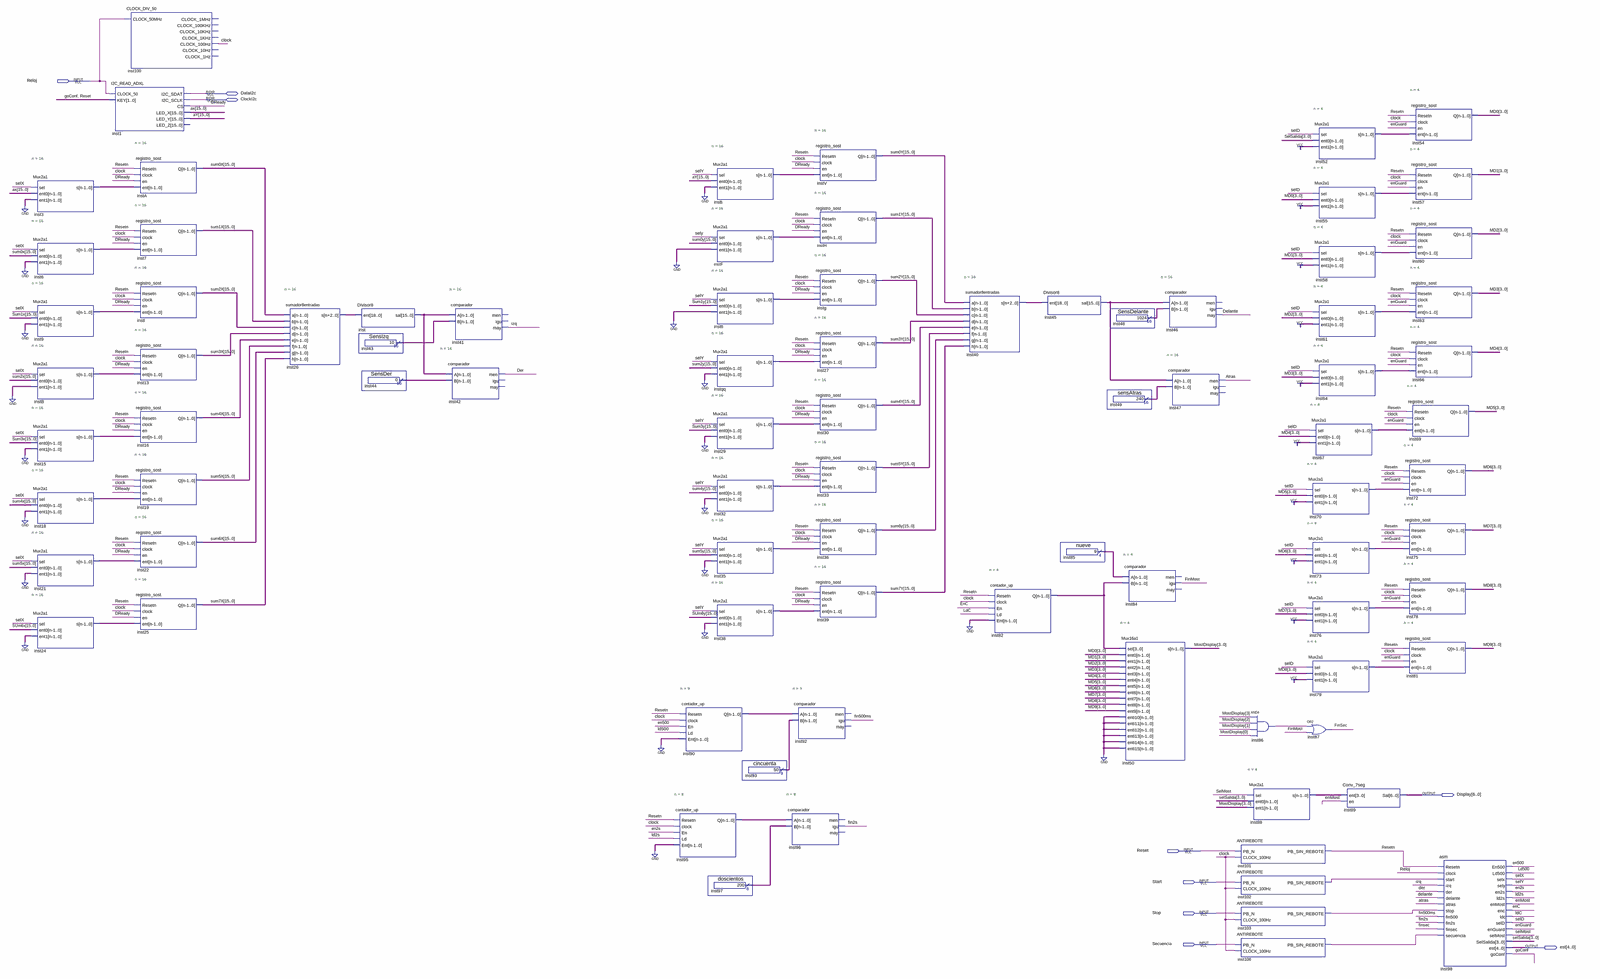
[diagram p0: schematic sheet, whole]
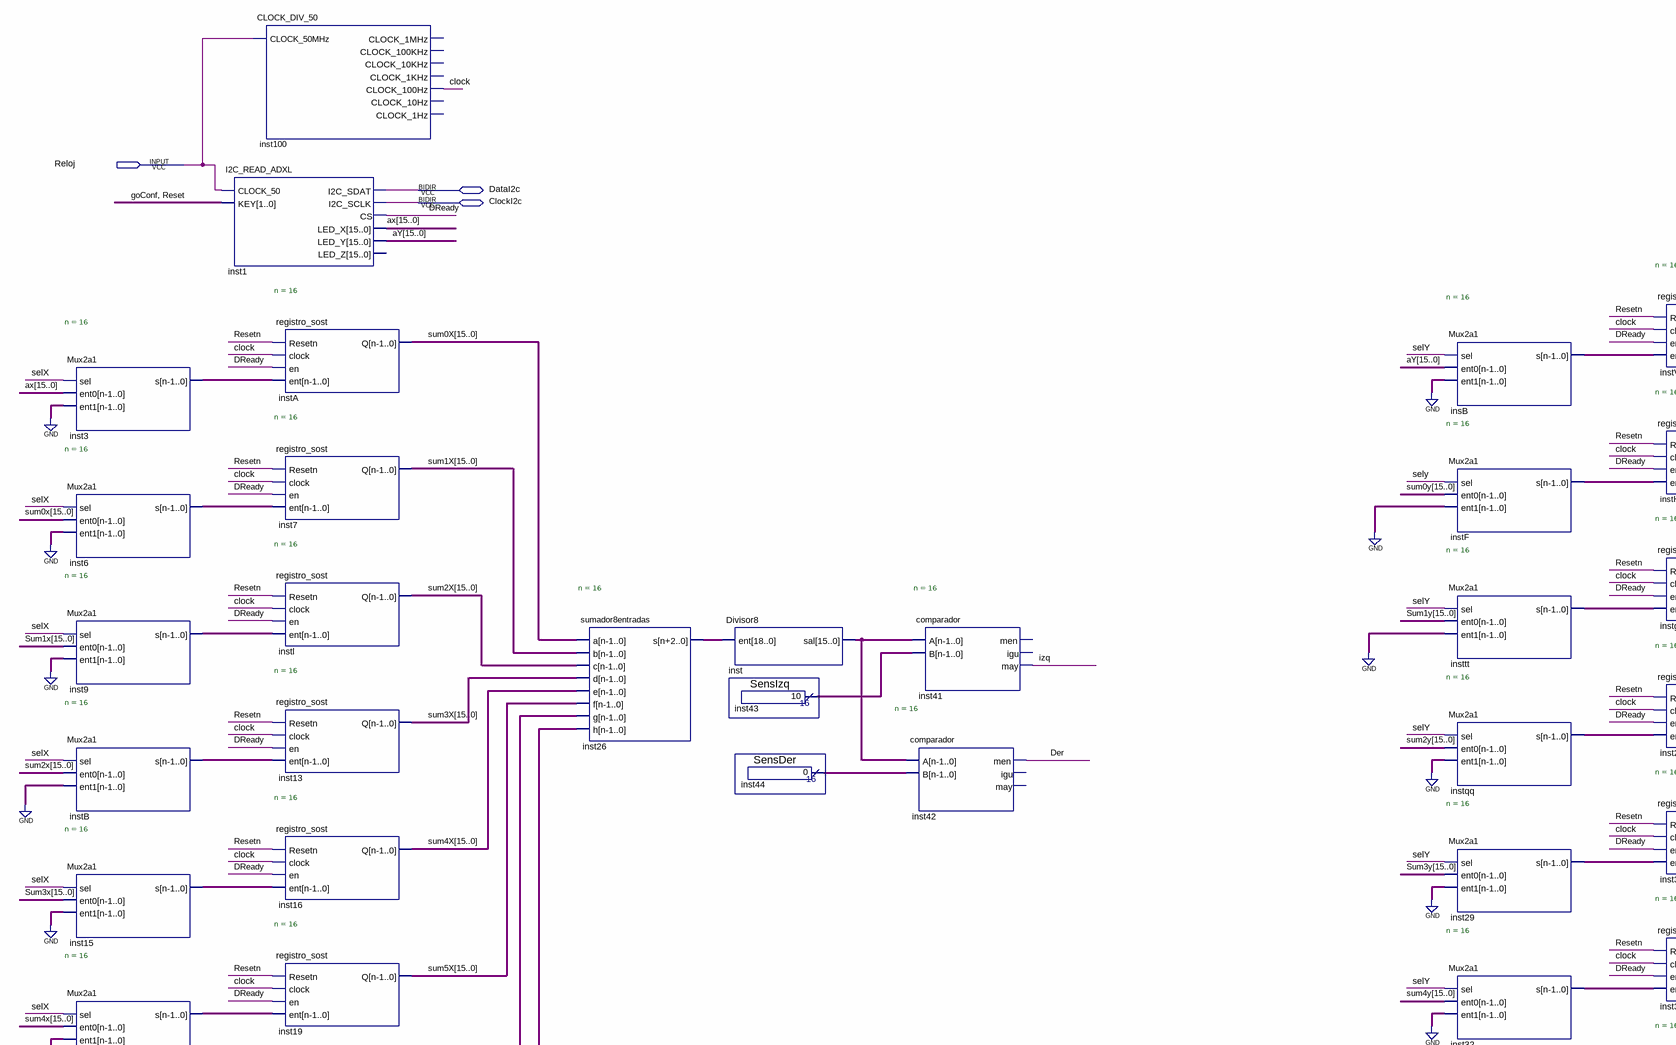
[diagram p1: schematic sheet, upper left part]
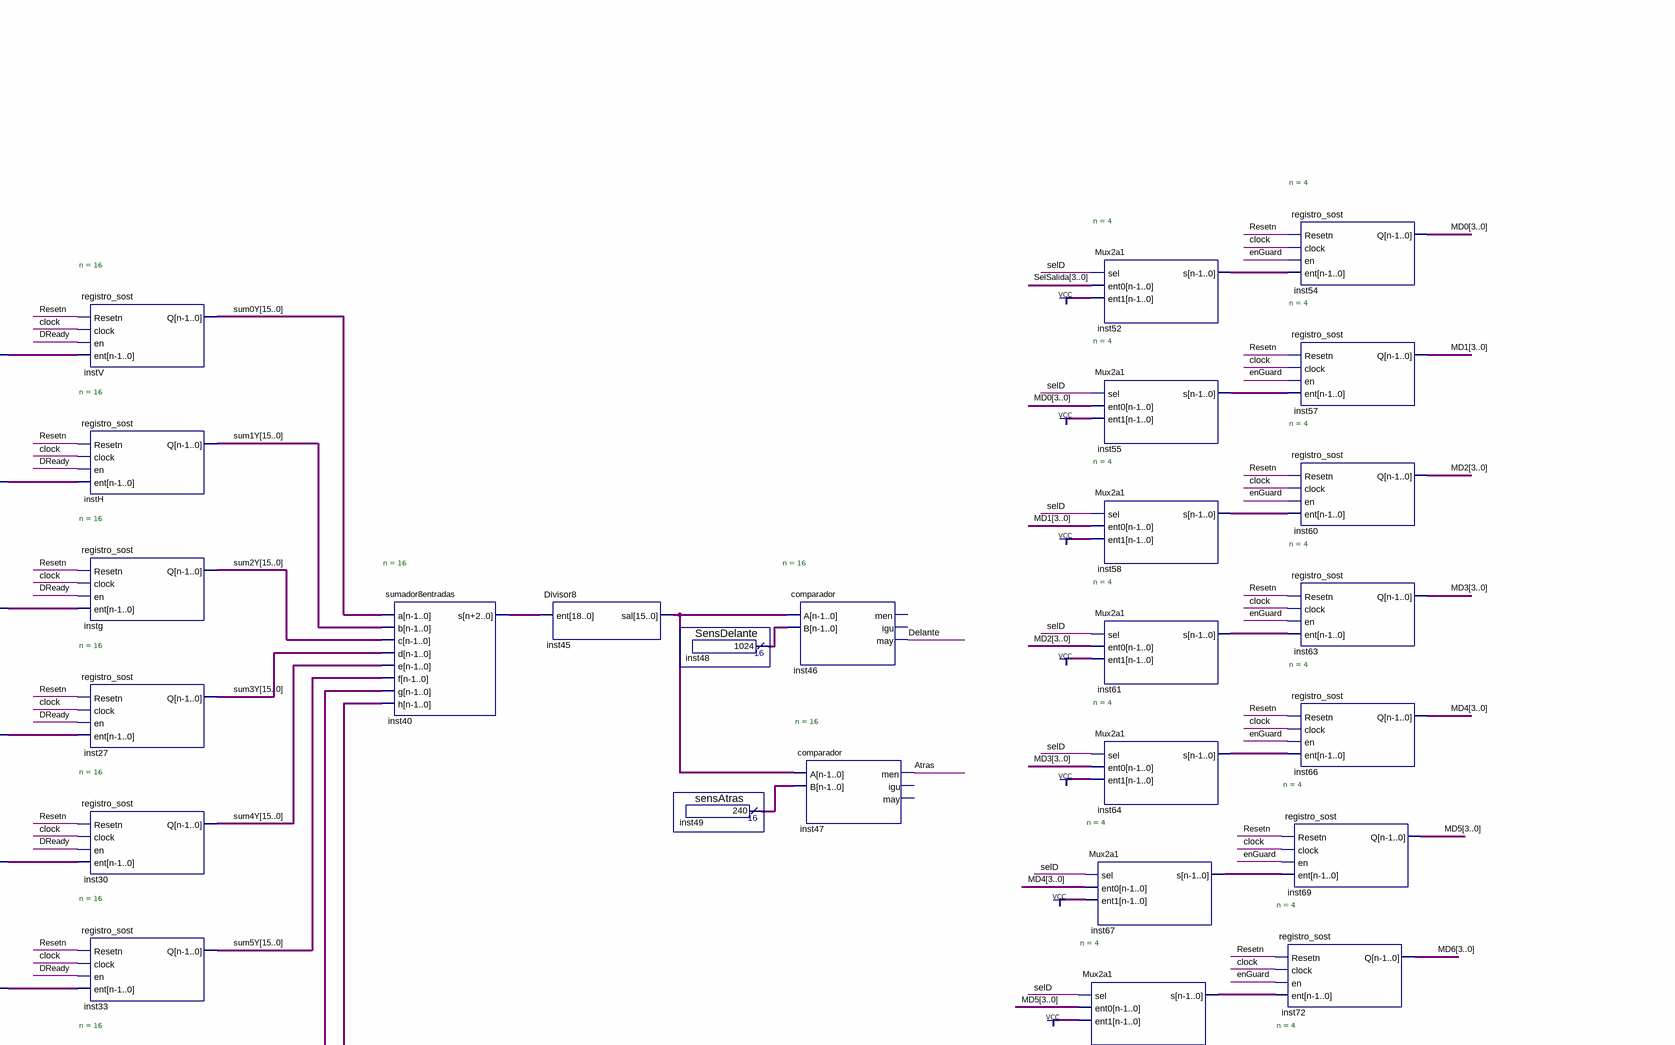
[diagram p2: schematic sheet, upper right part]
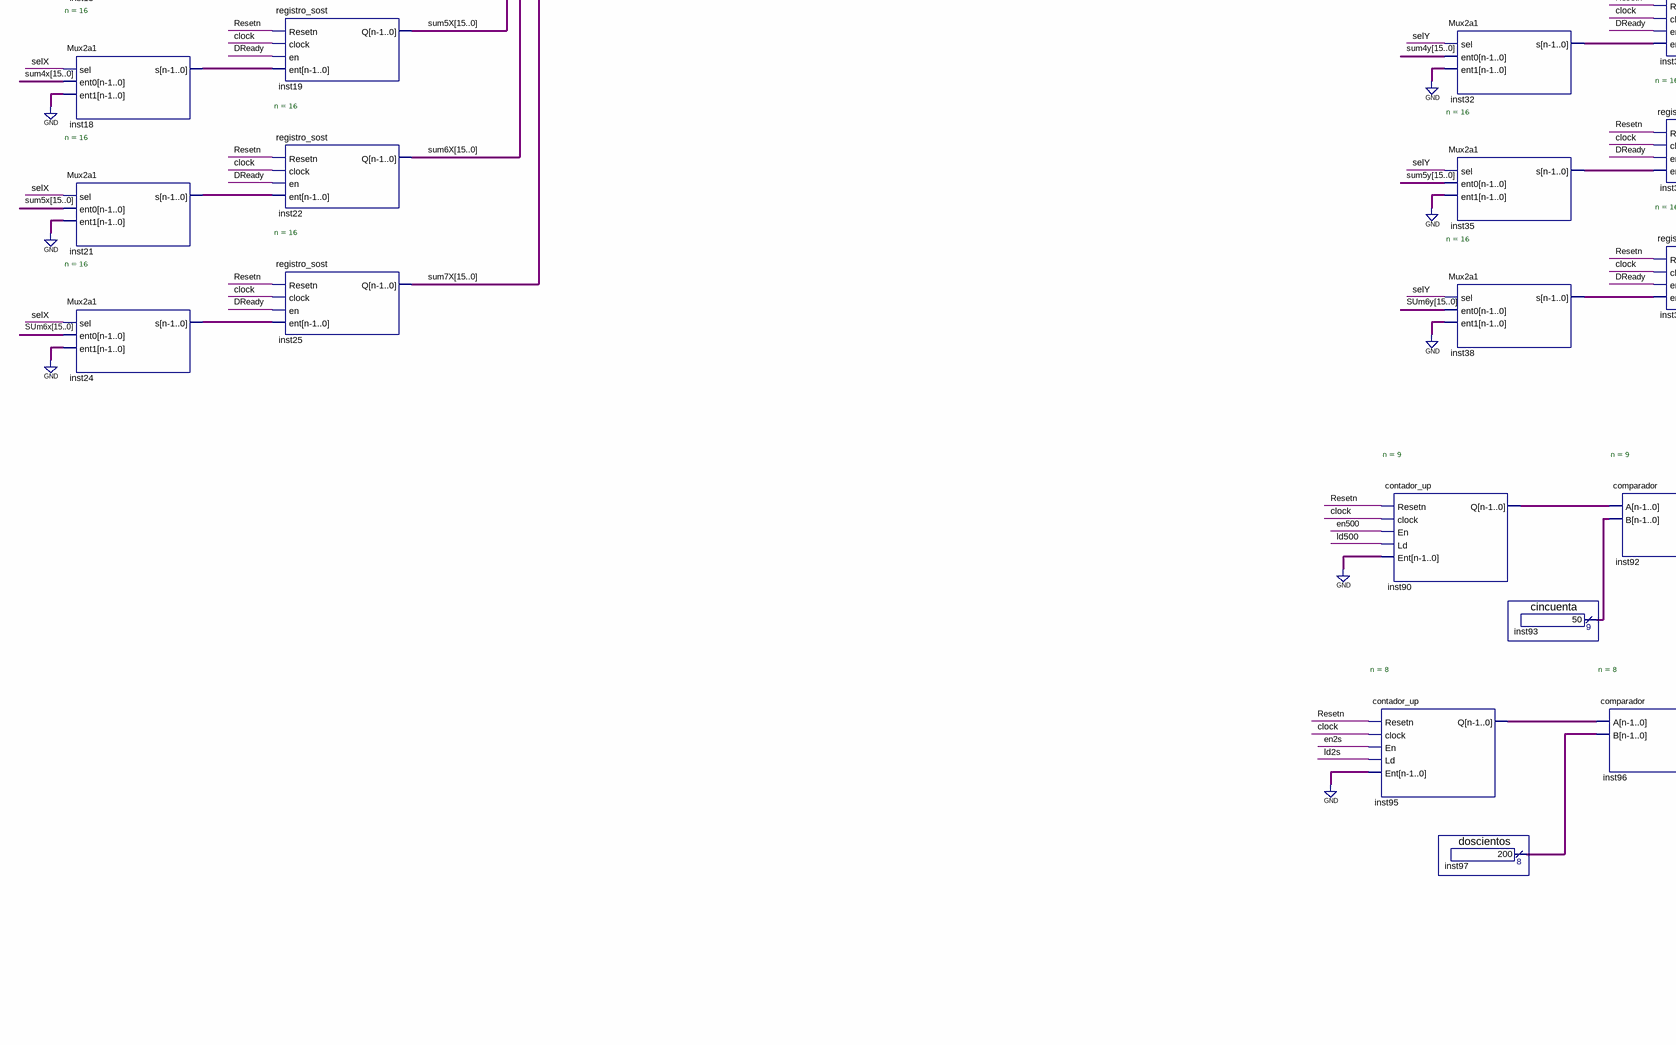
[diagram p3: schematic sheet, lower left part]
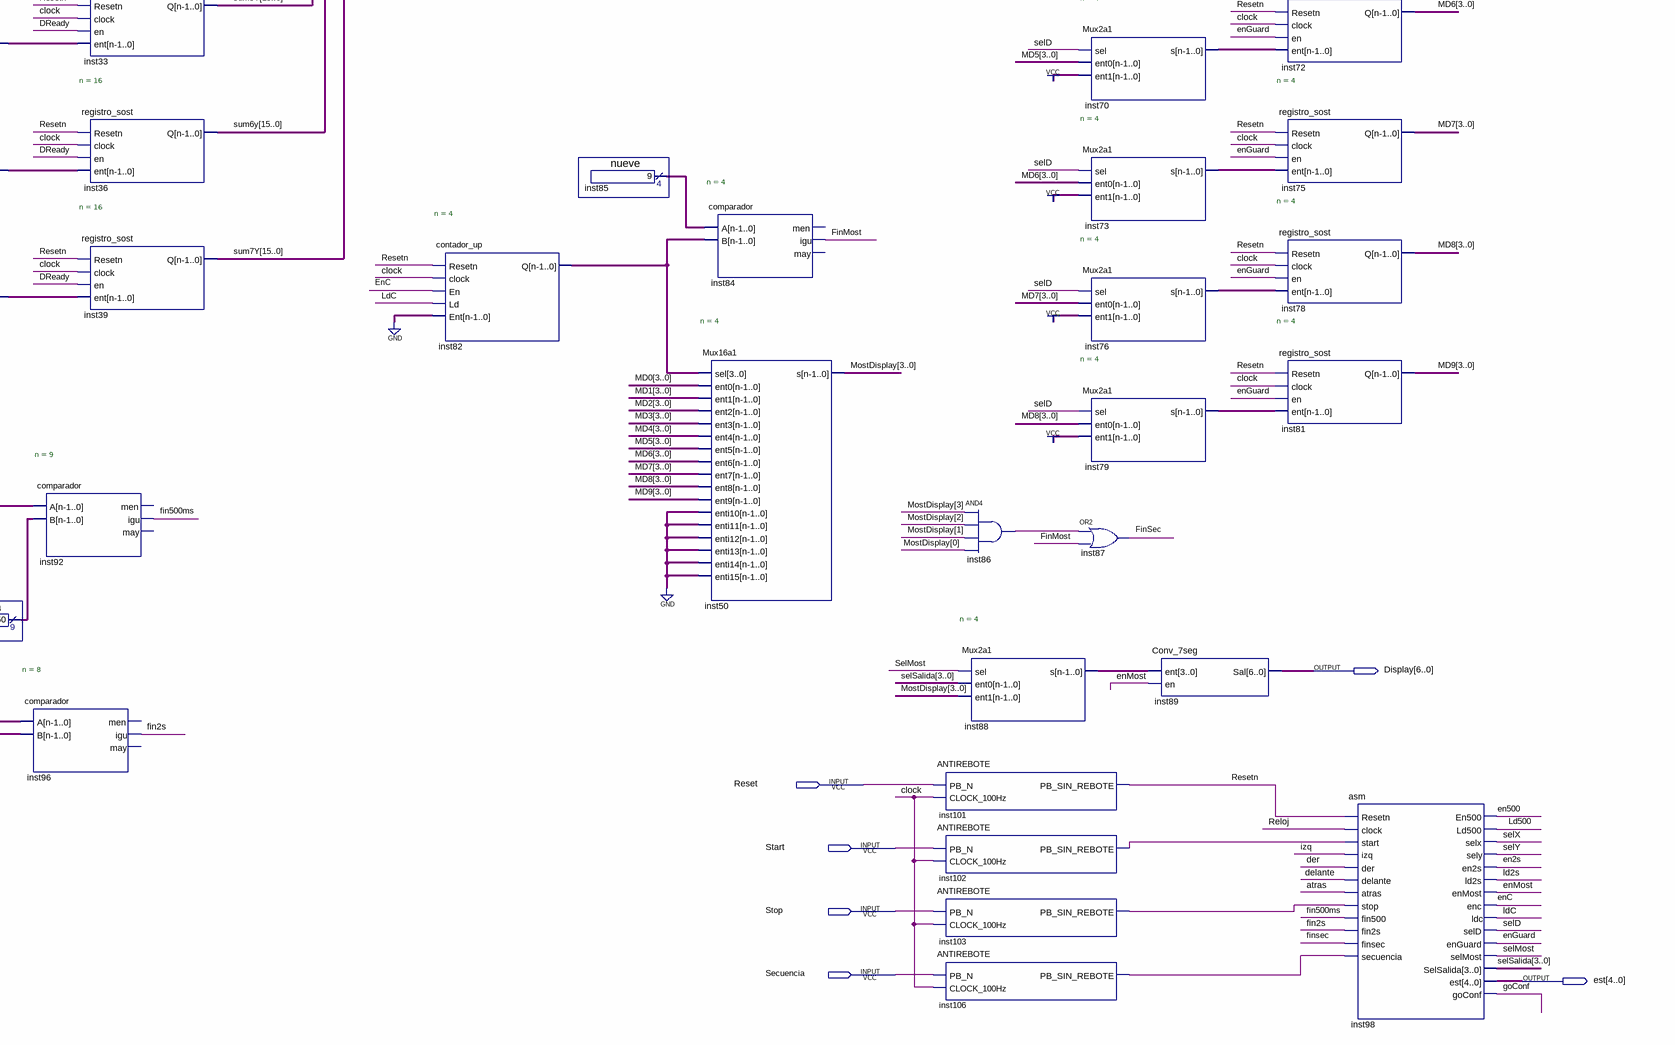
[diagram p4: schematic sheet, lower right part]
// Quartus schematic acelerometer.bdf as structural Verilog: 85 symbols, 9 pins
module acelerometer (
  input  Reloj,
  input  Reset,
  input  Start,
  input  Stop,
  input  Secuencia,
  inout  DataI2c,
  inout  ClockI2c,
  output [6:0] Display,
  output [4:0] est
);

  wire Atras, clock, Delante, Der, DReady, en2s, en500, EnC, enGuard, enMost, fin2s, fin500ms, FinMost,
       FinSec, goConf, inst86_out, inst102_pb_sin_rebote, inst103_pb_sin_rebote, inst106_pb_sin_rebote, izq,
       ld2s, ld500, LdC, Resetn, selD, SelMost, selX, selY;
  wire [3:0] inst52_s, inst55_s, inst58_s, inst61_s, inst64_s, inst67_s, inst70_s, inst73_s, inst76_s,
       inst79_s, inst82_q, inst85_result, inst88_s, MD0, MD1, MD2, MD3, MD4, MD5, MD6, MD7, MD8, MD9,
       MostDisplay, SelSalida;
  wire [7:0] inst95_q, inst97_result;
  wire [8:0] inst90_q, inst93_result;
  wire [15:0] ax, aY, insB_s, inst3_s, inst6_s, inst9_s, inst15_s, inst18_s, inst21_s, inst24_s, inst29_s,
       inst32_s, inst35_s, inst38_s, inst43_result, inst44_result, inst45_sal, inst48_result, inst49_result,
       inst_sal, instB_s, instF_s, instqq_s, insttt_s, sum0x, sum0y, Sum1x, Sum1y, sum2x, sum2y, sum3X,
       Sum3y, sum4x, sum4y, sum5x, sum5y, SUm6x, SUm6y, sum7X, sum7Y;
  wire [18:0] inst26_s, inst40_s;

  Mux2a1 #(.n(16)) inst3 (.sel(selX), .ent0(ax), .ent1({16{1'b0}}), .s(inst3_s));
  Mux2a1 #(.n(16)) inst6 (.sel(selX), .ent0(sum0x), .ent1({16{1'b0}}), .s(inst6_s));
  Mux2a1 #(.n(16)) inst9 (.sel(selX), .ent0(Sum1x), .ent1({16{1'b0}}), .s(inst9_s));
  Mux2a1 #(.n(16)) instB (.sel(selX), .ent0(sum2x), .ent1({16{1'b0}}), .s(instB_s));
  Mux2a1 #(.n(16)) inst15 (.sel(selX), .ent0(sum3X), .ent1({16{1'b0}}), .s(inst15_s));
  Mux2a1 #(.n(16)) inst18 (.sel(selX), .ent0(sum4x), .ent1({16{1'b0}}), .s(inst18_s));
  Mux2a1 #(.n(16)) inst21 (.sel(selX), .ent0(sum5x), .ent1({16{1'b0}}), .s(inst21_s));
  Mux2a1 #(.n(16)) inst24 (.sel(selX), .ent0(SUm6x), .ent1({16{1'b0}}), .s(inst24_s));
  CLOCK_DIV_50 inst100 (
    .CLOCK_50MHz(Reloj), .CLOCK_100Hz(clock));  // open: CLOCK_1MHz, CLOCK_100KHz, CLOCK_10KHz, CLOCK_1KHz, CLOCK_10Hz, CLOCK_1Hz
  I2C_READ_ADXL inst1 (
    .CLOCK_50(Reloj), .KEY({goConf, Reset}), .I2C_SCLK(ClockI2c), .CS(DReady), .LED_X(ax), .LED_Y(aY),
    .I2C_SDAT(DataI2c));  // open: LED_Z
  registro_sost #(.n(16)) instA (.Resetn(Resetn), .clock(clock), .en(DReady), .ent(inst3_s), .Q(sum0x));
  registro_sost #(.n(16)) inst7 (.Resetn(Resetn), .clock(clock), .en(DReady), .ent(inst6_s), .Q(Sum1x));
  registro_sost #(.n(16)) instl (.Resetn(Resetn), .clock(clock), .en(DReady), .ent(inst9_s), .Q(sum2x));
  registro_sost #(.n(16)) inst13 (.Resetn(Resetn), .clock(clock), .en(DReady), .ent(instB_s), .Q(sum3X));
  registro_sost #(.n(16)) inst16 (.Resetn(Resetn), .clock(clock), .en(DReady), .ent(inst15_s), .Q(sum4x));
  registro_sost #(.n(16)) inst19 (.Resetn(Resetn), .clock(clock), .en(DReady), .ent(inst18_s), .Q(sum5x));
  registro_sost #(.n(16)) inst22 (.Resetn(Resetn), .clock(clock), .en(DReady), .ent(inst21_s), .Q(SUm6x));
  registro_sost #(.n(16)) inst25 (.Resetn(Resetn), .clock(clock), .en(DReady), .ent(inst24_s), .Q(sum7X));
  sumador8entradas #(.n(16)) inst26 (
    .a(sum0x), .b(Sum1x), .c(sum2x), .d(sum3X), .e(sum4x), .f(sum5x), .g(SUm6x), .h(sum7X), .s(inst26_s));
  Divisor8 inst (.ent(inst26_s), .sal(inst_sal));
  SensIzq inst43 (.result(inst43_result));
  SensDer inst44 (.result(inst44_result));
  comparador #(.n(16)) inst41 (.A(inst_sal), .B(inst43_result), .may(izq));  // open: men, igu
  comparador #(.n(16)) inst42 (.A(inst_sal), .B(inst44_result), .men(Der));  // open: igu, may
  contador_up #(.n(9)) inst90 (.Resetn(Resetn), .clock(clock), .En(en500), .Ld(ld500), .Ent({9{1'b0}}), .Q(inst90_q));
  contador_up #(.n(8)) inst95 (.Resetn(Resetn), .clock(clock), .En(en2s), .Ld(ld2s), .Ent({8{1'b0}}), .Q(inst95_q));
  Mux2a1 #(.n(16)) insB (.sel(selY), .ent0(aY), .ent1({16{1'b0}}), .s(insB_s));
  Mux2a1 #(.n(16)) instF (.sel(selY), .ent0(sum0y), .ent1({16{1'b0}}), .s(instF_s));
  Mux2a1 #(.n(16)) insttt (.sel(selY), .ent0(Sum1y), .ent1({16{1'b0}}), .s(insttt_s));
  Mux2a1 #(.n(16)) instqq (.sel(selY), .ent0(sum2y), .ent1({16{1'b0}}), .s(instqq_s));
  Mux2a1 #(.n(16)) inst29 (.sel(selY), .ent0(Sum3y), .ent1({16{1'b0}}), .s(inst29_s));
  Mux2a1 #(.n(16)) inst32 (.sel(selY), .ent0(sum4y), .ent1({16{1'b0}}), .s(inst32_s));
  Mux2a1 #(.n(16)) inst35 (.sel(selY), .ent0(sum5y), .ent1({16{1'b0}}), .s(inst35_s));
  Mux2a1 #(.n(16)) inst38 (.sel(selY), .ent0(SUm6y), .ent1({16{1'b0}}), .s(inst38_s));
  doscientos inst97 (.result(inst97_result));
  cincuenta inst93 (.result(inst93_result));
  comparador #(.n(9)) inst92 (.A(inst90_q), .B(inst93_result), .igu(fin500ms));  // open: men, may
  comparador #(.n(8)) inst96 (.A(inst95_q), .B(inst97_result), .igu(fin2s));  // open: men, may
  registro_sost #(.n(16)) instV (.Resetn(Resetn), .clock(clock), .en(DReady), .ent(insB_s), .Q(sum0y));
  registro_sost #(.n(16)) instH (.Resetn(Resetn), .clock(clock), .en(DReady), .ent(instF_s), .Q(Sum1y));
  registro_sost #(.n(16)) instg (.Resetn(Resetn), .clock(clock), .en(DReady), .ent(insttt_s), .Q(sum2y));
  registro_sost #(.n(16)) inst27 (.Resetn(Resetn), .clock(clock), .en(DReady), .ent(instqq_s), .Q(Sum3y));
  registro_sost #(.n(16)) inst30 (.Resetn(Resetn), .clock(clock), .en(DReady), .ent(inst29_s), .Q(sum4y));
  registro_sost #(.n(16)) inst33 (.Resetn(Resetn), .clock(clock), .en(DReady), .ent(inst32_s), .Q(sum5y));
  registro_sost #(.n(16)) inst36 (.Resetn(Resetn), .clock(clock), .en(DReady), .ent(inst35_s), .Q(SUm6y));
  registro_sost #(.n(16)) inst39 (.Resetn(Resetn), .clock(clock), .en(DReady), .ent(inst38_s), .Q(sum7Y));
  sumador8entradas #(.n(16)) inst40 (
    .a(sum0y), .b(Sum1y), .c(sum2y), .d(Sum3y), .e(sum4y), .f(sum5y), .g(SUm6y), .h(sum7Y), .s(inst40_s));
  contador_up #(.n(4)) inst82 (.Resetn(Resetn), .clock(clock), .En(EnC), .Ld(LdC), .Ent(4'b0000), .Q(inst82_q));
  Divisor8 inst45 (.ent(inst40_s), .sal(inst45_sal));
  nueve inst85 (.result(inst85_result));
  SensDelante inst48 (.result(inst48_result));
  sensAtras inst49 (.result(inst49_result));
  comparador #(.n(4)) inst84 (.A(inst85_result), .B(inst82_q), .igu(FinMost));  // open: men, may
  Mux16a1 #(.n(4)) inst50 (
    .sel(inst82_q), .ent0(MD0), .ent1(MD1), .ent2(MD2), .ent3(MD3), .ent4(MD4), .ent5(MD5), .ent6(MD6),
    .ent7(MD7), .ent8(MD8), .ent9(MD9), .enti10(4'b0000), .enti11(4'b0000), .enti12(4'b0000),
    .enti13(4'b0000), .enti14(4'b0000), .enti15(4'b0000), .s(MostDisplay));
  comparador #(.n(16)) inst46 (.A(inst45_sal), .B(inst48_result), .may(Delante));  // open: men, igu
  comparador #(.n(16)) inst47 (.A(inst45_sal), .B(inst49_result), .men(Atras));  // open: igu, may
  and inst86 (inst86_out, MostDisplay[3], MostDisplay[2], MostDisplay[1], MostDisplay[0]);
  Mux2a1 #(.n(4)) inst88 (.sel(SelMost), .ent0(SelSalida), .ent1(MostDisplay), .s(inst88_s));
  ANTIREBOTE inst101 (.PB_N(Reset), .CLOCK_100Hz(clock), .PB_SIN_REBOTE(Resetn));
  ANTIREBOTE inst102 (.PB_N(Start), .CLOCK_100Hz(clock), .PB_SIN_REBOTE(inst102_pb_sin_rebote));
  ANTIREBOTE inst103 (.PB_N(Stop), .CLOCK_100Hz(clock), .PB_SIN_REBOTE(inst103_pb_sin_rebote));
  ANTIREBOTE inst106 (.PB_N(Secuencia), .CLOCK_100Hz(clock), .PB_SIN_REBOTE(inst106_pb_sin_rebote));
  Mux2a1 #(.n(4)) inst52 (.sel(selD), .ent0(SelSalida), .ent1(4'b1111), .s(inst52_s));
  Mux2a1 #(.n(4)) inst55 (.sel(selD), .ent0(MD0), .ent1(4'b1111), .s(inst55_s));
  Mux2a1 #(.n(4)) inst58 (.sel(selD), .ent0(MD1), .ent1(4'b1111), .s(inst58_s));
  Mux2a1 #(.n(4)) inst61 (.sel(selD), .ent0(MD2), .ent1(4'b1111), .s(inst61_s));
  Mux2a1 #(.n(4)) inst64 (.sel(selD), .ent0(MD3), .ent1(4'b1111), .s(inst64_s));
  Mux2a1 #(.n(4)) inst67 (.sel(selD), .ent0(MD4), .ent1(4'b1111), .s(inst67_s));
  Mux2a1 #(.n(4)) inst70 (.sel(selD), .ent0(MD5), .ent1(4'b1111), .s(inst70_s));
  Mux2a1 #(.n(4)) inst73 (.sel(selD), .ent0(MD6), .ent1(4'b1111), .s(inst73_s));
  Mux2a1 #(.n(4)) inst76 (.sel(selD), .ent0(MD7), .ent1(4'b1111), .s(inst76_s));
  Mux2a1 #(.n(4)) inst79 (.sel(selD), .ent0(MD8), .ent1(4'b1111), .s(inst79_s));
  or inst87 (FinSec, inst86_out, FinMost);
  Conv_7seg inst89 (.ent(inst88_s), .en(enMost), .Sal(Display));
  registro_sost #(.n(4)) inst72 (.Resetn(Resetn), .clock(clock), .en(enGuard), .ent(inst70_s), .Q(MD6));
  registro_sost #(.n(4)) inst75 (.Resetn(Resetn), .clock(clock), .en(enGuard), .ent(inst73_s), .Q(MD7));
  registro_sost #(.n(4)) inst78 (.Resetn(Resetn), .clock(clock), .en(enGuard), .ent(inst76_s), .Q(MD8));
  registro_sost #(.n(4)) inst81 (.Resetn(Resetn), .clock(clock), .en(enGuard), .ent(inst79_s), .Q(MD9));
  registro_sost #(.n(4)) inst54 (.Resetn(Resetn), .clock(clock), .en(enGuard), .ent(inst52_s), .Q(MD0));
  registro_sost #(.n(4)) inst57 (.Resetn(Resetn), .clock(clock), .en(enGuard), .ent(inst55_s), .Q(MD1));
  registro_sost #(.n(4)) inst60 (.Resetn(Resetn), .clock(clock), .en(enGuard), .ent(inst58_s), .Q(MD2));
  registro_sost #(.n(4)) inst63 (.Resetn(Resetn), .clock(clock), .en(enGuard), .ent(inst61_s), .Q(MD3));
  registro_sost #(.n(4)) inst66 (.Resetn(Resetn), .clock(clock), .en(enGuard), .ent(inst64_s), .Q(MD4));
  registro_sost #(.n(4)) inst69 (.Resetn(Resetn), .clock(clock), .en(enGuard), .ent(inst67_s), .Q(MD5));
  asm inst98 (
    .Resetn(Resetn), .clock(Reloj), .start(inst102_pb_sin_rebote), .izq(izq), .der(Der), .delante(Delante),
    .atras(Atras), .stop(inst103_pb_sin_rebote), .fin500(fin500ms), .fin2s(fin2s), .finsec(FinSec),
    .secuencia(inst106_pb_sin_rebote), .En500(en500), .Ld500(ld500), .selx(selX), .sely(selY), .en2s(en2s),
    .ld2s(ld2s), .enMost(enMost), .enc(EnC), .ldc(LdC), .selD(selD), .enGuard(enGuard), .selMost(SelMost),
    .SelSalida(SelSalida), .est(est), .goConf(goConf));
endmodule
